# Altium schematic sheet Battery Charger.SchDoc
size A4
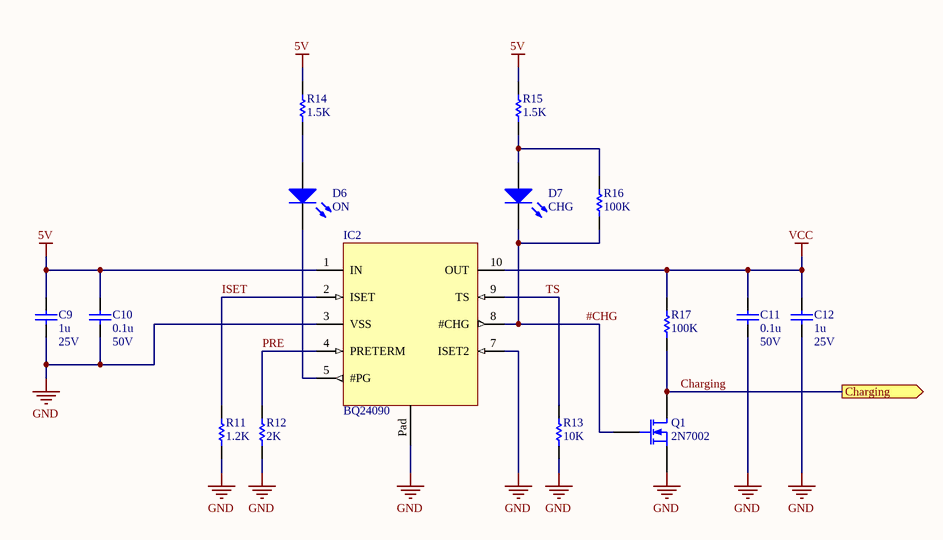
[diagram p0: Battery Charger.SchDoc]

## Parts
C9  1u  Rated Voltage: 25V  [C1206]
C10  0.1u  Rated Voltage: 50V  [C1206]
C11  0.1u  Rated Voltage: 50V  [C1206]
C12  1u  Rated Voltage: 25V  [C1206]
D6  ON  [LED3015M]
D7  CHG  [LED3015M]
IC2  BQ24090  [TSSOP50P490X110_HS-11N]
Q1  2N7002  [SOT65P210X110-3N]
R11  1.2K  [R1206]
R12  2K  [R1206]
R13  10K  [R1206]
R14  1.5K  [R1206]
R15  1.5K  [R1206]
R16  100K  [R1206]
R17  100K  [R1206]

## Ports
Charging (out)

## Nets
5V: C9.2 C10.2 IC2.1(IN) R14.2 R15.2
GND: C9.1 C10.1 C11.1 C12.1 IC2.3(VSS) IC2.7(ISET2) IC2.Pad(Thermal) Q1.2(S) R11.1 R12.1 R13.1
VCC: C11.2 C12.2 IC2.10(OUT) R17.2
#CHG: D7.2(K) IC2.8(#CHG) Q1.1(G) R16.1
Charging: Q1.3(D) R17.1 ; port Charging
ISET: IC2.2(ISET) R11.2
PRE: IC2.4(PRETERM) R12.2
TS: IC2.9(TS) R13.2
NetD6_1: D6.1(A) R14.1
NetD6_2: D6.2(K) IC2.5(#PG)
NetD7_1: D7.1(A) R15.1 R16.2

## Library data of the parts
C9-C12 = Capacitor
  C9 C12: Value: 1u
  C10 C11: Value: 0.1u
D6 D7 = LED
IC2 = BQ24090: Battery Charger, Single Cell Li-Ion/LiPo, 1A
Q1 = 2N7002: Transistor, MOSFET, N-Channel, 60V, 300mA
R11-R17 = Resistor: Power: *
  R11: Value: 1.2K
  R12: Value: 2K
  R13: Value: 10K
  R14 R15: Value: 1.5K
  R16 R17: Value: 100K